# EAGLE design EHDD_LAB_5 (EAGLE 7.7.0)
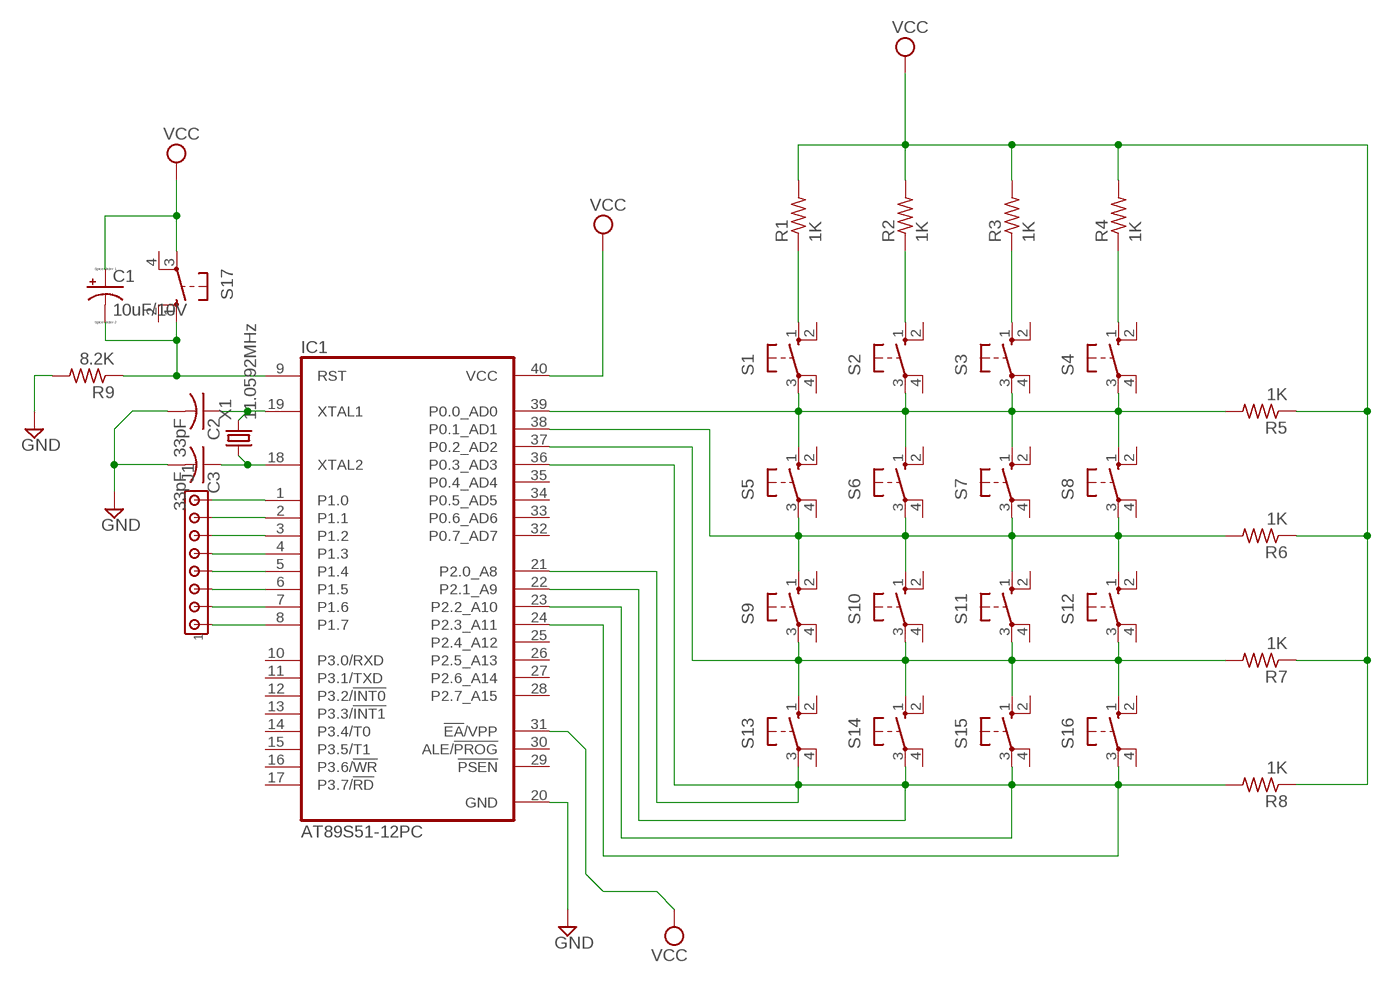
[diagram p0: schematic, sheet 1]

## Parts
C1  10uF/10V  CPOL-US153CLV-0505  [153CLV-0505]
C2  33pF  C-USC0603  [C0603]
C3  33pF  C-USC0603  [C0603]
IC1  AT89S51-12PC  AT89C51-12PC  [DIL40]
J1  MTA08-100  [10X08MTA]
R1  1K  R-US_R0603  [R0603]
R2  1K  R-US_R0603  [R0603]
R3  1K  R-US_R0603  [R0603]
R4  1K  R-US_R0603  [R0603]
R5  1K  R-US_R0603  [R0603]
R6  1K  R-US_R0603  [R0603]
R7  1K  R-US_R0603  [R0603]
R8  1K  R-US_R0603  [R0603]
R9  8.2K  R-US_R0603  [R0603]
S1  10-XX  [B3F-10XX]
S2  10-XX  [B3F-10XX]
S3  10-XX  [B3F-10XX]
S4  10-XX  [B3F-10XX]
S5  10-XX  [B3F-10XX]
S6  10-XX  [B3F-10XX]
S7  10-XX  [B3F-10XX]
S8  10-XX  [B3F-10XX]
S9  10-XX  [B3F-10XX]
S10  10-XX  [B3F-10XX]
S11  10-XX  [B3F-10XX]
S12  10-XX  [B3F-10XX]
S13  10-XX  [B3F-10XX]
S14  10-XX  [B3F-10XX]
S15  10-XX  [B3F-10XX]
S16  10-XX  [B3F-10XX]
S17  10-XX  [B3F-10XX]
X1  11.0592MHz  CRYSTALS-NOGND-HC49/4H  [HC49]

## Nets
GND: C2.2 C3.2 IC1.20(GND) R9.2
N$1: R1.1 S1.1(S)
N$2: R2.1 S2.1(S)
N$3: R3.1 S3.1(S)
N$4: R4.1 S4.1(S)
N$5: IC1.39(P0.0_AD0) R5.2 S1.3(P) S2.3(P) S3.3(P) S4.3(P) S5.1(S) S6.1(S) S7.1(S) S8.1(S)
N$7: IC1.1(P1.0) J1.8
N$8: IC1.2(P1.1) J1.7
N$9: IC1.38(P0.1_AD1) R6.2 S5.3(P) S6.3(P) S7.3(P) S8.3(P) S9.1(S) S10.1(S) S11.1(S) S12.1(S)
N$10: IC1.3(P1.2) J1.6
N$11: IC1.4(P1.3) J1.5
N$12: IC1.5(P1.4) J1.4
N$13: IC1.37(P0.2_AD2) R7.2 S9.3(P) S10.3(P) S11.3(P) S12.3(P) S13.1(S) S14.1(S) S15.1(S) S16.1(S)
N$14: IC1.6(P1.5) J1.3
N$15: IC1.7(P1.6) J1.2
N$16: IC1.8(P1.7) J1.1
N$17: IC1.21(P2.0_A8) IC1.22(P2.1_A9) IC1.23(P2.2_A10) IC1.24(P2.3_A11) IC1.36(P0.3_AD3) R8.2 S13.3(P) S14.3(P) S15.3(P) S16.3(P)
N$26: C1.- IC1.9(RST) R9.1 S17.1(S)
N$30: C2.1 IC1.19(XTAL1) X1.2
N$31: C3.1 IC1.18(XTAL2) X1.1
VCC: C1.+ IC1.31(!EA!/VPP) IC1.40(VCC) R1.2 R2.2 R3.2 R4.2 R5.1 R6.1 R7.1 R8.1 S17.3(P)
Unconnected: IC1.10(P3.0/RXD) IC1.11(P3.1/TXD) IC1.12(P3.2/!INT0) IC1.13(P3.3/!INT1) IC1.14(P3.4/T0) IC1.15(P3.5/T1) IC1.16(P3.6/!WR) IC1.17(P3.7/!RD) IC1.25(P2.4_A12) IC1.26(P2.5_A13) IC1.27(P2.6_A14) IC1.28(P2.7_A15) IC1.29(!PSEN) IC1.30(ALE/!PROG) IC1.32(P0.7_AD7) IC1.33(P0.6_AD6) IC1.34(P0.5_AD5) IC1.35(P0.4_AD4) S1.2(S1) S1.4(P1) S2.2(S1) S2.4(P1) S3.2(S1) S3.4(P1) S4.2(S1) S4.4(P1) S5.2(S1) S5.4(P1) S6.2(S1) S6.4(P1) S7.2(S1) S7.4(P1) S8.2(S1) S8.4(P1) S9.2(S1) S9.4(P1) S10.2(S1) S10.4(P1) S11.2(S1) S11.4(P1) S12.2(S1) S12.4(P1) S13.2(S1) S13.4(P1) S14.2(S1) S14.4(P1) S15.2(S1) S15.4(P1) S16.2(S1) S16.4(P1) S17.2(S1) S17.4(P1)

## Library data of the parts
C1 = resistor:CPOL-US: POLARIZED CAPACITOR, American symbol
C2 C3 = rcl:C-US: CAPACITOR, American symbol
IC1 = atmel:AT89C51-*: 8-bit Microcontroller with 4K Bytes Flash Not Recommended for New Designs. Use AT89S51. Source: http://www.atmel.com/dyn/resources/prod_documents/doc0265.; OC_FARNELL: unknown; OC_NEWARK: unknown
J1 = con-amp:MTA08-100: AMP connector
R1-R9 = rcl:R-US_: RESISTOR, American symbol
S1-S17 = switch-omron:10-XX: OMRON SWITCH; MPN: B3F-1000; OC_FARNELL: 176432; OC_NEWARK: 36M3542
X1 = IQD-Frequency-Products:CRYSTALS-NOGND: CRYSTALS CAN NOT GROUNDED

## Board
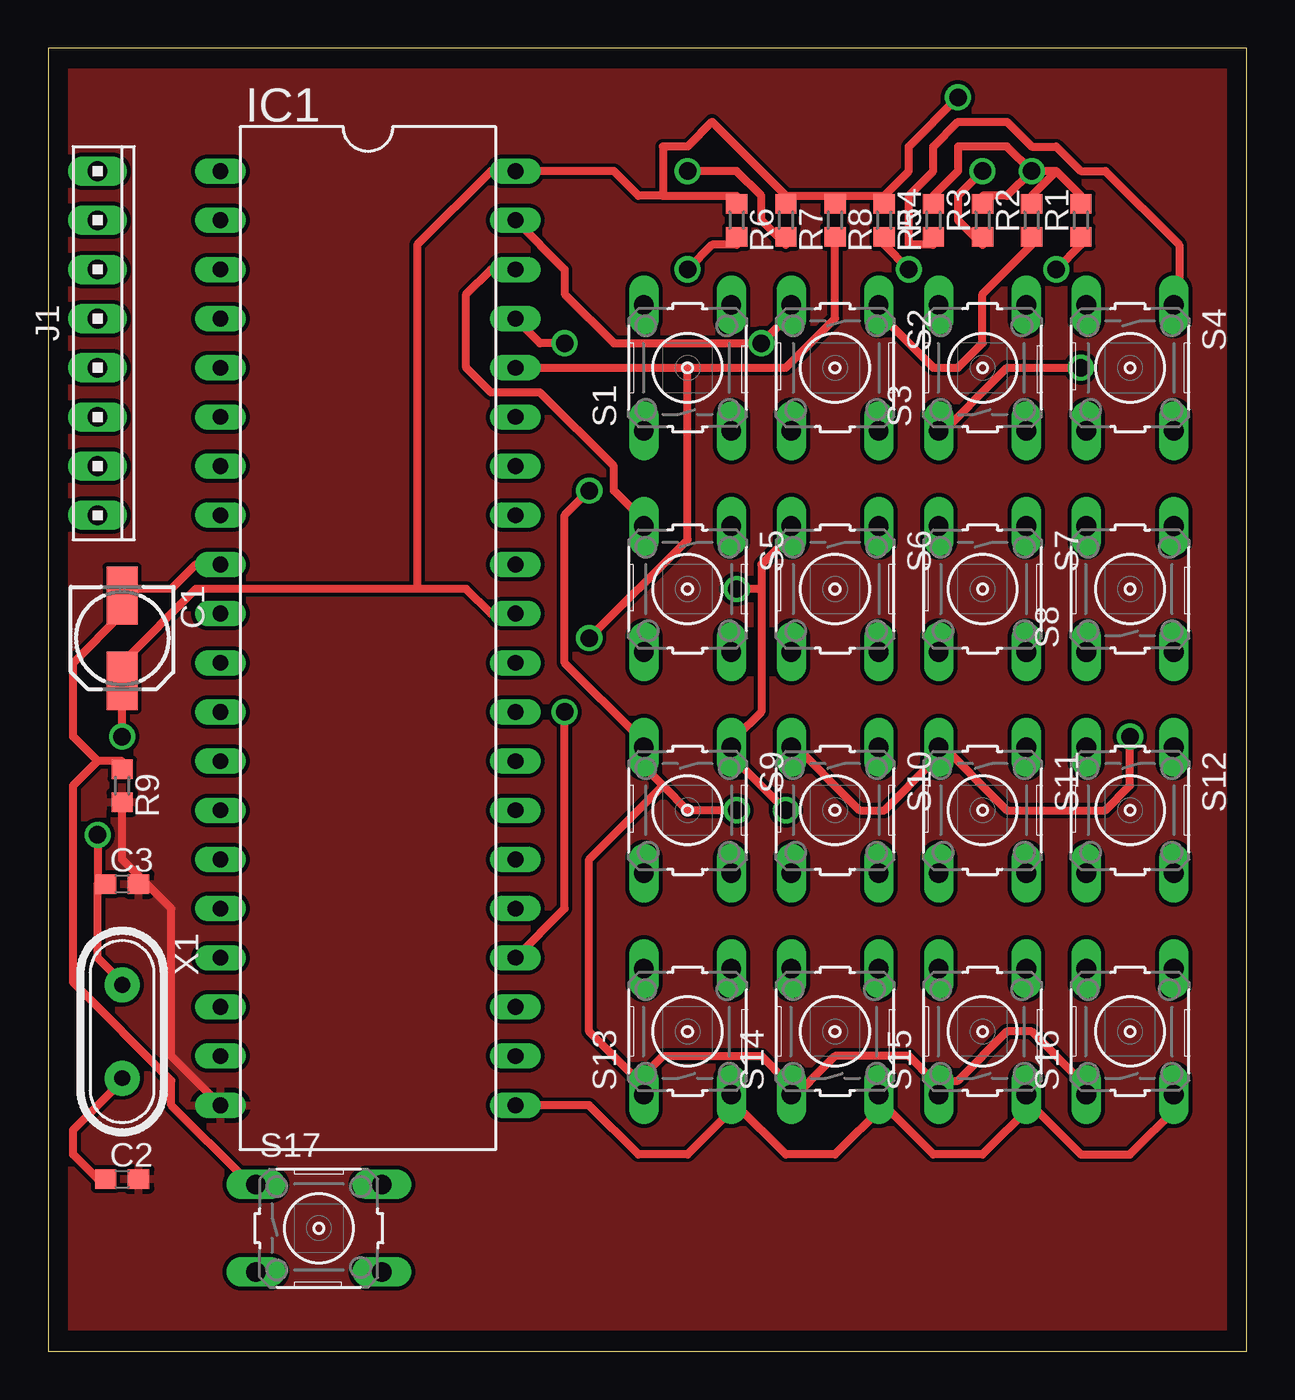
[diagram p1: board, top side]
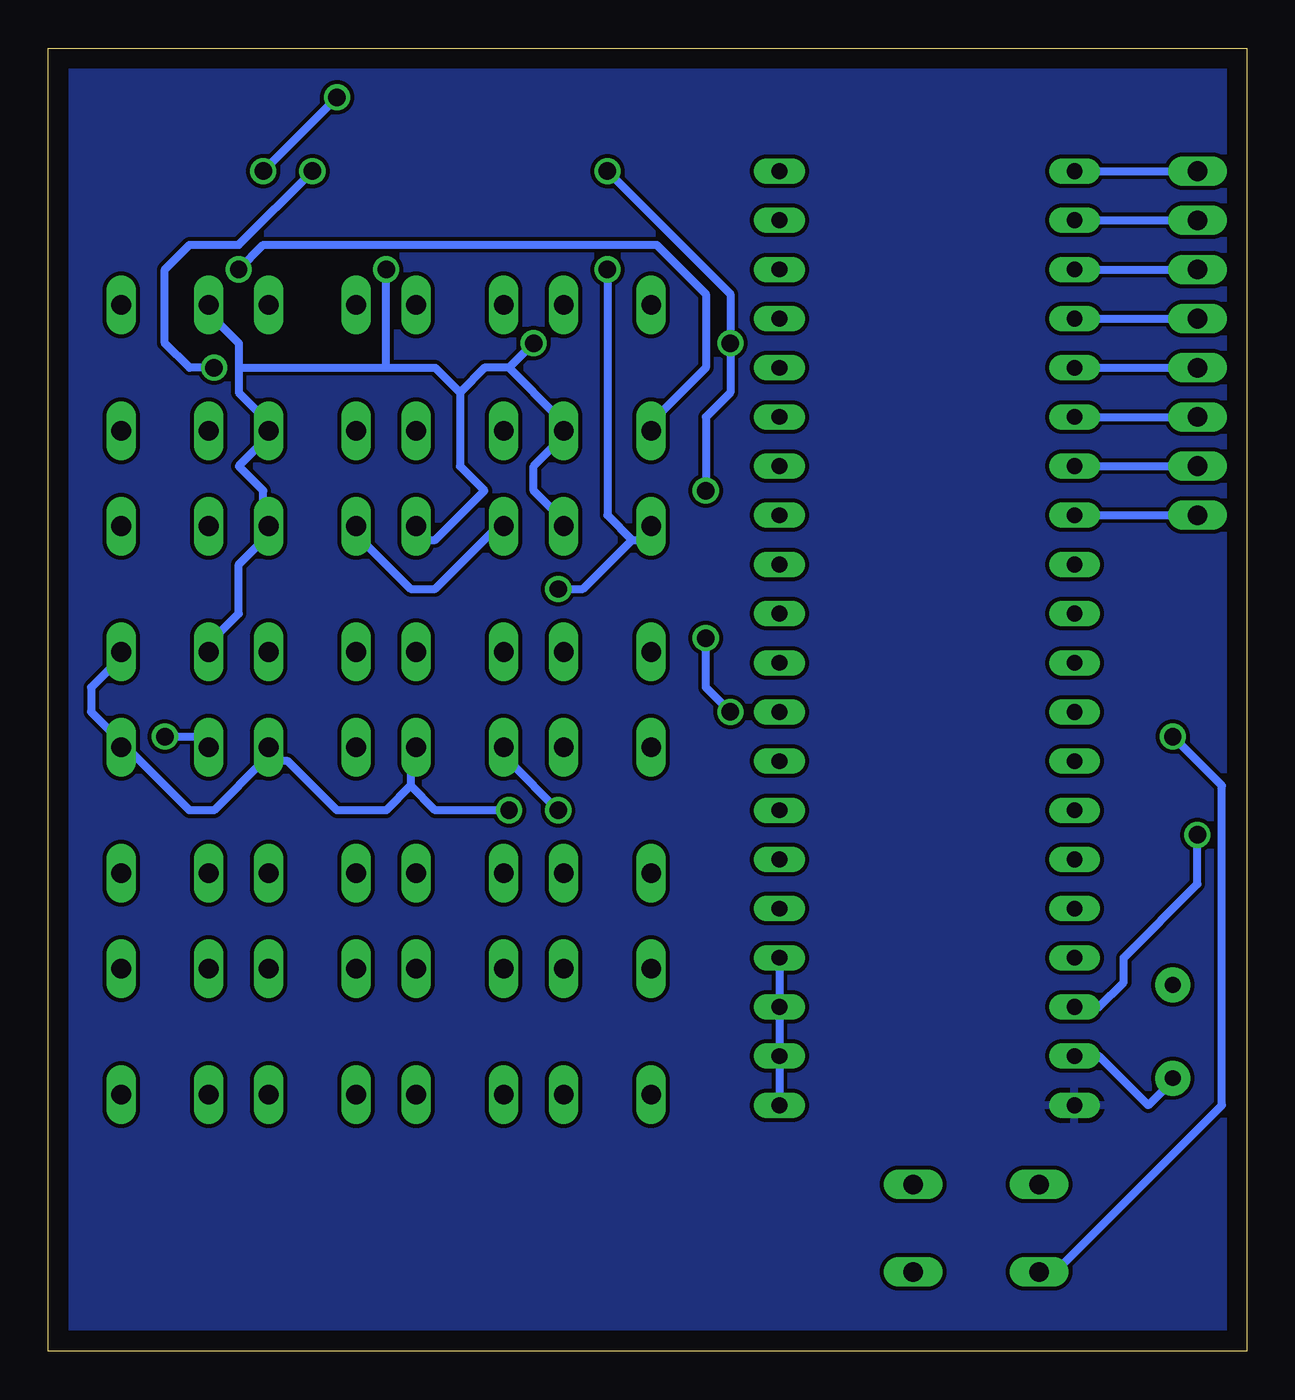
[diagram p2: board, bottom side, seen from below]

Size 61.9 x 67.3 mm. Coordinates in mm from the lower left corner, seen from the top.
Outline: 0,0 61.9,0 61.9,67.3 0,67.3 0,0
Copper layers (1*16): Top 0.035mm / dielectric 1.5mm / Bottom 0.035mm
Design rules "default": minimum track width 10mil, minimum drill 24mil, track to track 8mil, track to pad 8mil, pad to pad 8mil, via to via 8mil, smd to smd 8mil, copper to edge 40mil, drill to drill 8mil, minimum pad ring 10mil, minimum via ring 8mil, stop-mask expansion 4mil, vias tented up to drill 0mil, thermal gap 10mil

### Footprints (pad centres in the part's own frame; a part is rotated, then mirrored left to right if it is on the bottom)
153CLV-0505 = smd 3 x 1.6: + 2.2,0; - -2.2,0
C0603 = smd 1.1 x 1: 1 -0.85,0; 2 0.85,0
DIL40 = drill 0.813 long: 1 -24.13,-7.62; 2 -21.59,-7.62; 3 -19.05,-7.62; 4 -16.51,-7.62; 5 -13.97,-7.62; 6 -11.43,-7.62; 7 -8.89,-7.62; 8 -6.35,-7.62; 9 -3.81,-7.62; 10 -1.27,-7.62; 11 1.27,-7.62; 12 3.81,-7.62; 13 6.35,-7.62; 14 8.89,-7.62; 15 11.43,-7.62; 16 13.97,-7.62; 17 16.51,-7.62; 18 19.05,-7.62; 19 21.59,-7.62; 20 24.13,-7.62; 21 24.13,7.62; 22 21.59,7.62; 23 19.05,7.62; 24 16.51,7.62; 25 13.97,7.62; 26 11.43,7.62; 27 8.89,7.62; 28 6.35,7.62; 29 3.81,7.62; 30 1.27,7.62; 31 -1.27,7.62; 32 -3.81,7.62; 33 -6.35,7.62; 34 -8.89,7.62; 35 -11.43,7.62; 36 -13.97,7.62; 37 -16.51,7.62; 38 -19.05,7.62; 39 -21.59,7.62; 40 -24.13,7.62
10X08MTA = drill 1.016 long: 1 8.89,0; 2 6.35,0; 3 3.81,0; 4 1.27,0; 5 -1.27,0; 6 -3.81,0; 7 -6.35,0; 8 -8.89,0
R0603 = smd 1 x 1.1: 1 -0.85,0; 2 0.85,0
B3F-10XX = drill 1.016 long: 1 -3.251,2.261; 2 3.251,2.261; 3 -3.251,-2.261; 4 3.251,-2.261
HC49 = drill 0.813 pad 1.8: 1 -2.413,0; 2 2.413,0

### Placement (x,y rotation side)
C1  3.81,36.83 270 top
C2  3.81,8.89 0 top
C3  3.81,24.13 0 top
IC1  16.51,36.83 270 top
J1  2.54,52.07 270 top
R1  53.34,58.42 90 top
R2  50.8,58.42 90 top
R3  48.26,58.42 90 top
R4  45.72,58.42 90 top
R5  43.18,58.42 270 top
R6  35.56,58.42 270 top
R7  38.1,58.42 270 top
R8  40.64,58.42 270 top
R9  3.81,29.21 270 top
S1  33.02,50.8 90 top
S2  40.64,50.8 270 top
S3  48.26,50.8 90 top
S4  55.88,50.8 270 top
S5  33.02,39.37 270 top
S6  40.64,39.37 270 top
S7  48.26,39.37 270 top
S8  55.88,39.37 90 top
S9  33.02,27.94 270 top
S10  40.64,27.94 270 top
S11  48.26,27.94 270 top
S12  55.88,27.94 270 top
S13  33.02,16.51 90 top
S14  40.64,16.51 90 top
S15  48.26,16.51 90 top
S16  55.88,16.51 90 top
S17  13.97,6.35 0 top
X1  3.81,16.51 270 top

### Tracks (layer width: path | path; a pad name or v marks a point on that pad's centre or on a via)
GND
  Top 0.406: R9.2 3.81,25.4 5.08,24.13 | 5.08,24.13 6.35,22.86 6.35,15.24 IC1.20 | 5.08,24.13 C3.2
  pour Top: 0,66.04 0,1.27 60.96,1.27 60.96,66.04
  pour Bottom: 0,66.04 60.96,66.04 60.96,1.27 0,1.27
N$1  (via drill 0.9)
  Top 0.406: v52.07,55.88 53.34,57.15 R1.1
  Bottom 0.406: v52.07,55.88 50.8,57.15 30.48,57.15 27.94,54.61 27.94,50.8 30.48,48.26 S1.1
N$2
  Top 0.406: R2.1 50.8,57.15 48.26,54.61 48.26,52.07 46.99,50.8 45.72,50.8 43.18,53.34 S2.1
N$3  (via drill 0.9)
  Top 0.406: v48.26,60.96 46.99,59.69 46.99,58.42 48.26,57.15 R3.1 | v53.34,50.8 49.53,50.8 45.72,46.99 S3.1
  Bottom 0.406: v48.26,60.96 52.07,57.15 54.61,57.15 55.88,55.88 55.88,52.07 54.61,50.8 v53.34,50.8
N$4
  Top 0.406: S4.1 58.42,54.61 58.42,57.15 54.61,60.96 53.34,60.96 52.07,62.23 50.8,62.23 49.53,63.5 46.99,63.5 45.72,62.23 45.72,60.96 44.45,59.69 44.45,57.15 45.72,57.15 R4.1
N$5  (via drill 0.9)
  Top 0.406: S2.3 38.1,53.34 v36.83,52.07 29.21,52.07 26.67,54.61 26.67,55.88 IC1.39 | v44.45,55.88 43.18,57.15 R5.2
  Bottom 0.406: S5.1 35.56,43.18 36.83,44.45 36.83,45.72 35.56,46.99 S1.3 35.56,48.26 38.1,50.8 | S6.1 43.18,41.91 41.91,41.91 39.37,44.45 40.64,45.72 40.64,49.53 | 40.64,49.53 39.37,50.8 38.1,50.8 | 52.07,50.8 52.07,52.07 53.34,53.34 S4.3 | 52.07,50.8 52.07,49.53 50.8,48.26 S3.3 50.8,46.99 52.07,45.72 50.8,44.45 50.8,43.18 S7.1 50.8,41.91 52.07,40.64 52.07,38.1 53.34,36.83 S8.1 | 40.64,49.53 41.91,50.8 44.45,50.8 | 52.07,50.8 44.45,50.8 | 38.1,50.8 v36.83,52.07 | 44.45,50.8 v44.45,55.88
N$7
  Bottom 0.406: IC1.1 J1.8
N$8
  Bottom 0.406: IC1.2 J1.7
N$9  (via drill 0.9)
  Top 0.406: v38.1,27.94 35.56,30.48 S9.1 35.56,31.75 36.83,33.02 36.83,39.37 | 36.83,39.37 36.83,40.64 38.1,41.91 S6.3 | 36.83,39.37 v35.56,39.37 | v33.02,55.88 34.29,57.15 35.56,57.15 R6.2 | IC1.38 22.86,55.88 21.59,54.61 21.59,50.8 22.86,49.53 25.4,49.53 29.21,45.72 29.21,44.45 30.48,43.18 S5.3
  Bottom 0.406: 43.18,29.21 41.91,27.94 v38.1,27.94 | 43.18,29.21 43.18,30.48 S10.1 | 58.42,31.75 59.69,33.02 59.69,34.29 58.42,35.56 S8.3 | 50.8,30.48 53.34,27.94 54.61,27.94 58.42,31.75 | 58.42,31.75 S12.1 | 50.8,30.48 49.53,30.48 46.99,27.94 44.45,27.94 43.18,29.21 | 50.8,30.48 S11.1 | 31.75,41.91 30.48,41.91 S5.3 | 31.75,41.91 34.29,39.37 v35.56,39.37 | S7.3 45.72,41.91 43.18,39.37 41.91,39.37 38.1,43.18 S6.3 | 31.75,41.91 33.02,43.18 v33.02,55.88
N$10
  Bottom 0.406: IC1.3 J1.6
N$11
  Bottom 0.406: IC1.4 J1.5
N$12
  Bottom 0.406: IC1.5 J1.4
N$13  (via drill 0.9)
  Top 0.406: v55.88,31.75 55.88,29.21 54.61,27.94 49.53,27.94 45.72,31.75 S11.3 45.72,30.48 43.18,27.94 41.91,27.94 38.1,31.75 S10.3 | 31.75,29.21 30.48,30.48 S9.3 30.48,31.75 26.67,35.56 26.67,43.18 v27.94,44.45 | 31.75,29.21 33.02,27.94 v35.56,27.94 | 31.75,29.21 27.94,25.4 27.94,16.51 30.48,13.97 | IC1.37 25.4,52.07 v26.67,52.07 | v33.02,60.96 35.56,60.96 36.83,59.69 36.83,58.42 38.1,57.15 R7.2 | 45.72,13.97 44.45,15.24 40.64,15.24 38.1,12.7 S14.1 38.1,13.97 36.83,15.24 31.75,15.24 30.48,13.97 | 45.72,13.97 46.99,13.97 49.53,16.51 50.8,16.51 53.34,13.97 S16.1 | 45.72,13.97 S15.1 | 30.48,13.97 S13.1
  Bottom 0.406: v55.88,31.75 53.34,31.75 S12.3 | v35.56,27.94 38.1,30.48 S10.3 | v33.02,60.96 26.67,54.61 v26.67,52.07 26.67,49.53 27.94,48.26 v27.94,44.45
N$14
  Bottom 0.406: IC1.6 J1.3
N$15
  Bottom 0.406: IC1.7 J1.2
N$16
  Bottom 0.406: IC1.8 J1.1
N$17  (via drill 0.9)
  Top 0.406: R8.2 40.64,53.34 38.1,50.8 33.02,50.8 | IC1.36 33.02,50.8 | 33.02,50.8 33.02,41.91 v27.94,36.83 | v26.67,33.02 26.67,22.86 IC1.24 | IC1.21 27.94,12.7 30.48,10.16 33.02,10.16 35.56,12.7 | 35.56,12.7 38.1,10.16 40.64,10.16 43.18,12.7 | 35.56,12.7 S13.3 | 43.18,12.7 45.72,10.16 48.26,10.16 50.8,12.7 | 43.18,12.7 S14.3 | 50.8,12.7 53.34,10.16 55.88,10.16 58.42,12.7 S16.3 | 50.8,12.7 S15.3
  Bottom 0.406: IC1.21 IC1.22 IC1.23 IC1.24 | v27.94,36.83 27.94,34.29 v26.67,33.02
N$26
  Top 0.406: IC1.9 7.62,40.64 6.35,39.37 3.81,39.37 C1.- 3.81,38.1 1.27,35.56 1.27,31.75 2.54,30.48 | 2.54,30.48 3.81,30.48 R9.1 | 2.54,30.48 1.27,29.21 1.27,19.05 6.35,13.97 6.35,12.7 10.16,8.89 S17.1
N$30
  Top 0.406: X1.2 3.81,13.97 1.27,11.43 1.27,10.16 2.54,8.89 C2.1
  Bottom 0.406: IC1.19 7.62,15.24 5.08,12.7 3.81,13.97 X1.2
N$31  (via drill 0.9)
  Top 0.406: 2.54,24.13 2.54,20.32 3.81,19.05 X1.1 | v2.54,26.67 2.54,24.13 | 2.54,24.13 C3.1
  Bottom 0.406: v2.54,26.67 2.54,24.13 6.35,20.32 6.35,19.05 7.62,17.78 IC1.18
VCC  (via drill 0.9)
  Top 0.406: 19.05,39.37 21.59,39.37 22.86,38.1 IC1.31 | 19.05,39.37 7.62,39.37 3.81,35.56 C1.+ v3.81,31.75 | 19.05,39.37 19.05,57.15 22.86,60.96 IC1.40 29.21,60.96 30.48,59.69 31.75,59.69 | 52.07,60.96 53.34,59.69 R1.2 | 52.07,60.96 50.8,59.69 R2.2 | v50.8,60.96 49.53,59.69 48.26,59.69 R3.2 | 52.07,60.96 v50.8,60.96 | v50.8,60.96 49.53,62.23 46.99,62.23 46.99,60.96 45.72,59.69 R4.2 | v46.99,64.77 44.45,62.23 44.45,60.96 43.18,59.69 | 31.75,59.69 35.56,59.69 R6.1 | 31.75,59.69 31.75,62.23 33.02,62.23 34.29,63.5 38.1,59.69 | 38.1,59.69 40.64,59.69 | 38.1,59.69 R7.1 | 40.64,59.69 43.18,59.69 | 43.18,59.69 R5.1 | 40.64,59.69 R8.1
  Bottom 0.406: v3.81,31.75 1.27,29.21 1.27,12.7 10.16,3.81 S17.3 | v46.99,64.77 v50.8,60.96